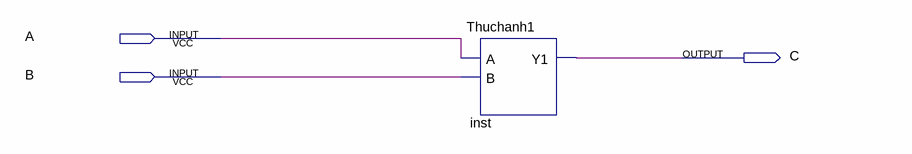
[diagram p0: schematic sheet]
// Quartus schematic Dong goiF1.bdf as structural Verilog: 1 symbols, 3 pins
module \Dong_goiF1  (
  input  A,
  input  B,
  output C
);

  Thuchanh1 inst (.A(A), .B(B), .Y1(C));
endmodule
